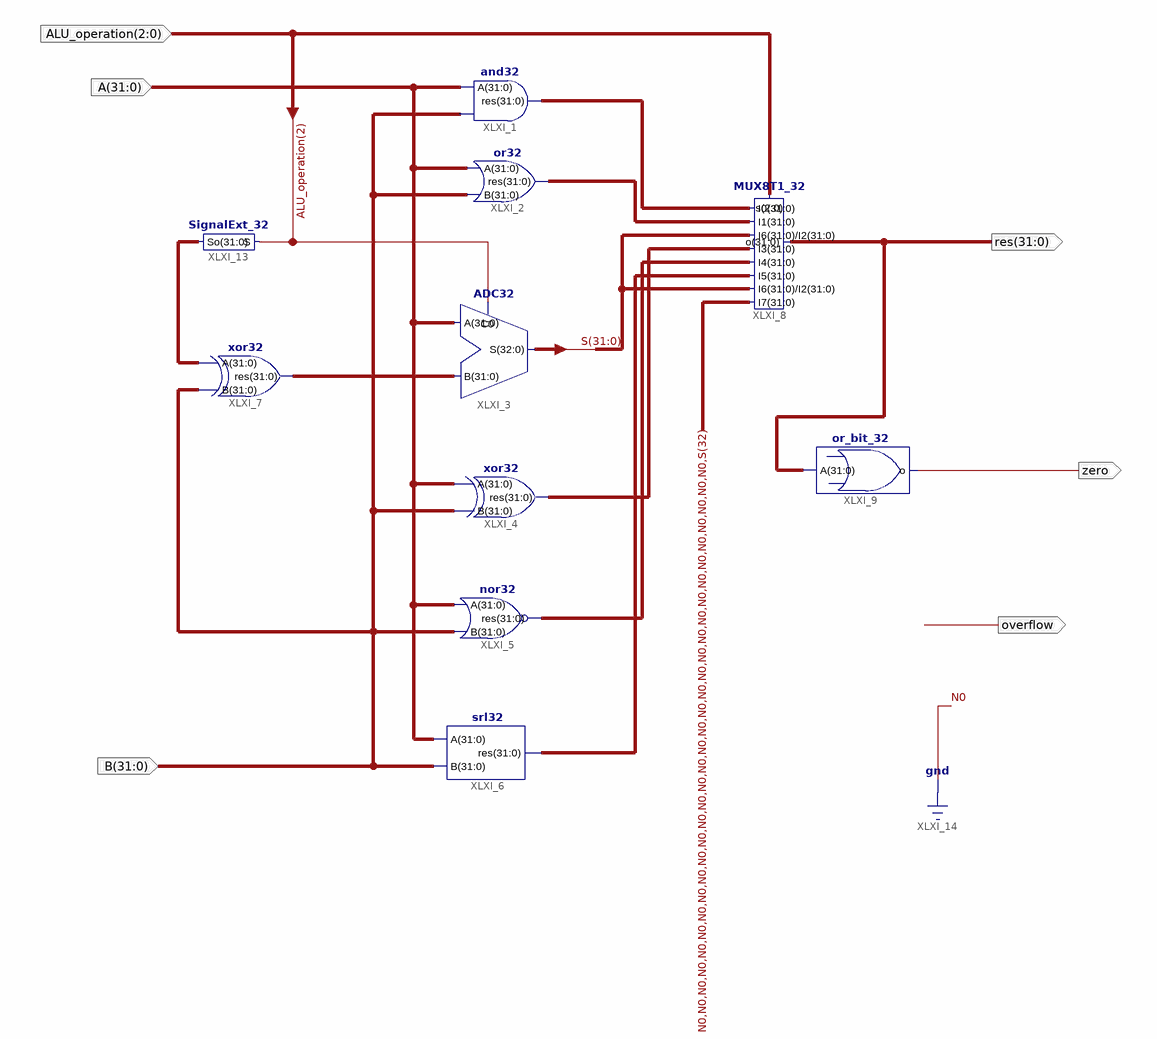
[diagram p0: schematic sheet 1]
// Xilinx ISE schematic ALU.sch (kintex7) as structural Verilog: 10 symbols, 6 ports
module ALU (
  input  [31:0] B,
  input  [31:0] A,
  input  [2:0] ALU_operation,
  output overflow,
  output zero,
  output [31:0] res
);

  wire [31:0] XLXN_16, XLXN_19, XLXN_23, XLXN_24, XLXN_31, XLXN_32, XLXN_33;
  wire [32:0] S;

  SignalExt_32 XLXI_13 (.So(XLXN_19), .S(ALU_operation[2]));
  srl32 XLXI_6 (.A(A), .B(B), .res(XLXN_33));
  or_bit_32 XLXI_9 (.o(zero), .A(res));
  MUX8T1_32 XLXI_8 (
    .s(ALU_operation), .I7({{31{1'b0}}, S[32]}), .I6(S[31:0]), .I5(XLXN_33), .I4(XLXN_32), .I3(XLXN_31),
    .I2(S[31:0]), .I1(XLXN_24), .I0(XLXN_23), .o(res));
  xor32 XLXI_7 (.A(XLXN_19), .B(B), .res(XLXN_16));
  nor32 XLXI_5 (.res(XLXN_32), .A(A), .B(B));
  xor32 XLXI_4 (.A(A), .B(B), .res(XLXN_31));
  ADC32 XLXI_3 (.B(XLXN_16), .A(A), .C0(ALU_operation[2]), .S(S));
  or32 XLXI_2 (.res(XLXN_24), .A(A), .B(B));
  and32 XLXI_1 (.res(XLXN_23), .A(A), .B(B));
endmodule
